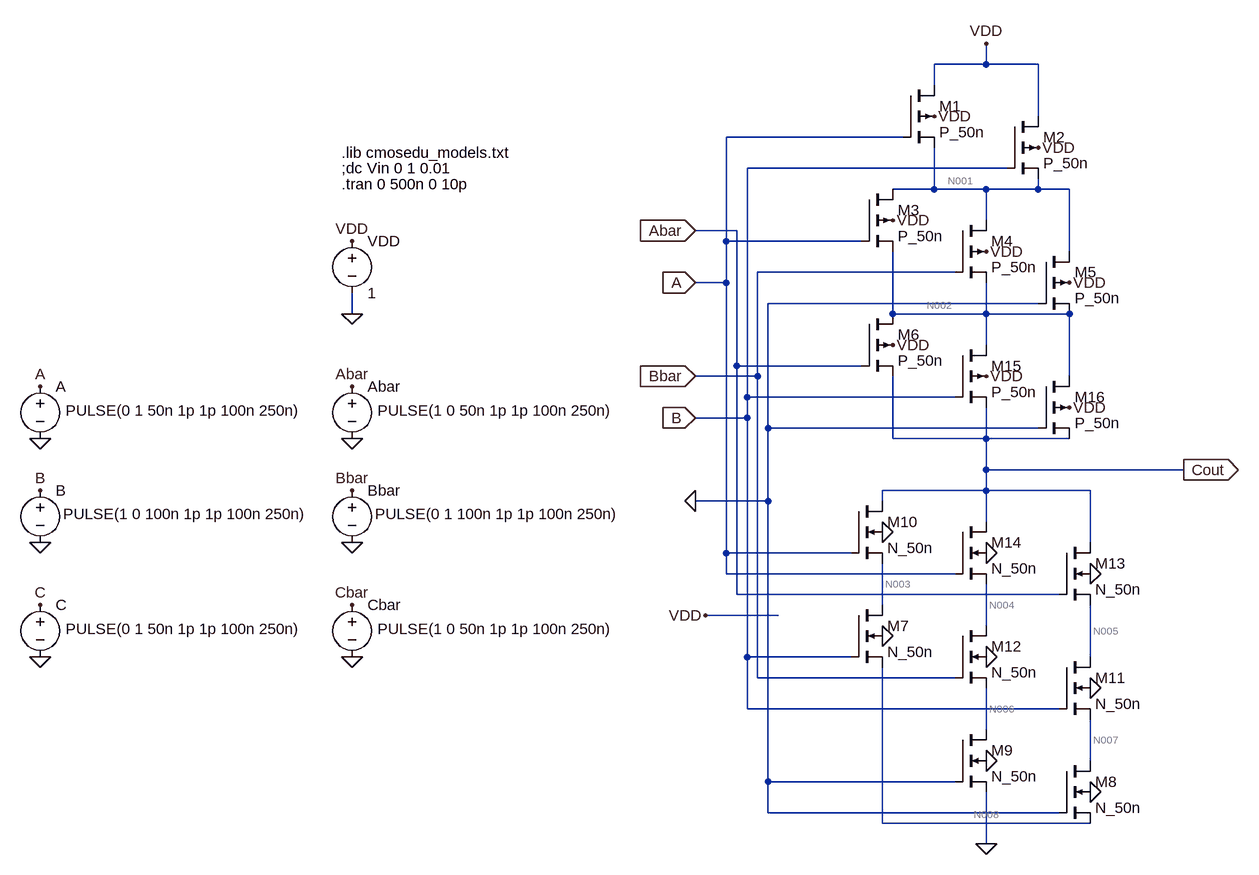
[diagram p0: schematic FA.asc]
FA.asc, the LTspice schematic file:
Version 4
SHEET 1 1044 680
WIRE 96 -624 96 -656
WIRE 96 -624 16 -624
WIRE 176 -624 96 -624
WIRE 16 -592 16 -624
WIRE 176 -544 176 -624
WIRE -32 -512 -304 -512
WIRE 128 -464 -272 -464
WIRE 16 -432 16 -496
WIRE 16 -432 -48 -432
WIRE 96 -432 16 -432
WIRE 176 -432 176 -448
WIRE 176 -432 96 -432
WIRE 224 -432 176 -432
WIRE 96 -384 96 -432
WIRE -288 -368 -352 -368
WIRE -304 -352 -304 -512
WIRE -96 -352 -304 -352
WIRE 224 -336 224 -432
WIRE 48 -304 -256 -304
WIRE -304 -288 -304 -352
WIRE -304 -288 -352 -288
WIRE 176 -256 -240 -256
WIRE -880 -240 -880 -272
WIRE -48 -240 -48 -336
WIRE 96 -240 96 -288
WIRE 96 -240 -48 -240
WIRE 224 -240 96 -240
WIRE 96 -192 96 -240
WIRE -288 -160 -288 -368
WIRE -96 -160 -288 -160
WIRE -256 -144 -256 -304
WIRE -256 -144 -352 -144
WIRE 224 -144 224 -240
WIRE -272 -112 -272 -464
WIRE 48 -112 -272 -112
WIRE -272 -80 -272 -112
WIRE -272 -80 -352 -80
WIRE -240 -64 -240 -256
WIRE 176 -64 -240 -64
WIRE -48 -48 -48 -144
WIRE 96 -48 96 -96
WIRE 96 -48 -48 -48
WIRE 224 -48 96 -48
WIRE 96 0 96 -48
WIRE 400 0 96 0
WIRE 96 32 96 0
WIRE 96 32 -64 32
WIRE 256 32 96 32
WIRE -240 48 -240 -64
WIRE -240 48 -352 48
WIRE -64 48 -64 32
WIRE 96 80 96 32
WIRE 256 112 256 32
WIRE -304 128 -304 -288
WIRE -112 128 -304 128
WIRE -304 160 -304 128
WIRE 48 160 -304 160
WIRE -288 192 -288 -160
WIRE 208 192 -288 192
WIRE -64 208 -64 144
WIRE -224 224 -336 224
WIRE 96 240 96 176
WIRE -272 288 -272 -80
WIRE -112 288 -272 288
WIRE 256 288 256 208
WIRE -256 320 -256 -144
WIRE 48 320 -256 320
WIRE -272 368 -272 288
WIRE 208 368 -272 368
WIRE 96 400 96 336
WIRE 256 448 256 384
WIRE -240 480 -240 48
WIRE 48 480 -240 480
WIRE -240 528 -240 480
WIRE 208 528 -240 528
WIRE -64 544 -64 304
WIRE 256 544 -64 544
WIRE 96 576 96 496
FLAG -880 -240 0
FLAG -880 -352 VDD
FLAG -880 -128 Abar
FLAG -880 32 Bbar
FLAG -880 -48 0
FLAG -880 112 0
FLAG 256 496 0
FLAG -64 256 0
FLAG 16 -544 VDD
FLAG 176 -496 VDD
FLAG 96 -336 VDD
FLAG -48 -384 VDD
FLAG -352 -368 Abar
IOPIN -352 -368 In
FLAG -352 -144 Bbar
IOPIN -352 -144 In
FLAG 96 576 0
FLAG 96 -656 VDD
FLAG 400 0 Cout
IOPIN 400 0 Out
FLAG -1360 -128 A
FLAG -1360 -48 0
FLAG -1360 32 B
FLAG -1360 112 0
FLAG -880 208 Cbar
FLAG -880 288 0
FLAG -1360 208 C
FLAG -1360 288 0
FLAG 96 448 0
FLAG 256 336 0
FLAG -64 96 0
FLAG 96 288 0
FLAG 256 160 0
FLAG 96 128 0
FLAG -352 -288 A
IOPIN -352 -288 In
FLAG -352 -80 B
IOPIN -352 -80 In
FLAG 224 -288 VDD
FLAG 96 -144 VDD
FLAG -48 -192 VDD
FLAG 224 -96 VDD
FLAG -352 48 0
FLAG -336 224 VDD
SYMBOL voltage -880 -368 R0
SYMATTR InstName VDD
SYMATTR Value 1
SYMBOL voltage -880 -144 R0
WINDOW 3 39 53 Left 2
WINDOW 123 0 0 Left 0
WINDOW 39 0 0 Left 0
SYMATTR Value PULSE(1 0 50n 1p 1p 100n 250n)
SYMATTR InstName Abar
SYMBOL voltage -880 16 R0
WINDOW 123 0 0 Left 0
WINDOW 39 0 0 Left 0
WINDOW 3 35 52 Left 2
SYMATTR Value PULSE(0 1 100n 1p 1p 100n 250n)
SYMATTR InstName Bbar
SYMBOL pmos4 -32 -592 R0
SYMATTR InstName M1
SYMATTR Value P_50n
SYMATTR Value2 l=50n w=0.12u
SYMBOL pmos4 128 -544 R0
SYMATTR InstName M2
SYMATTR Value P_50n
SYMATTR Value2 l=50n w=0.6u
SYMBOL pmos4 -96 -432 R0
SYMATTR InstName M3
SYMATTR Value P_50n
SYMATTR Value2 l=50n w=0.12u
SYMBOL pmos4 48 -384 R0
SYMATTR InstName M4
SYMATTR Value P_50n
SYMATTR Value2 l=50n w=0.12u
SYMBOL nmos4 -112 208 R0
SYMATTR InstName M7
SYMATTR Value N_50n
SYMATTR Value2 l=50n w=0.4u
SYMBOL nmos4 208 448 R0
SYMATTR InstName M8
SYMATTR Value N_50n
SYMATTR Value2 l=50n w=0.6u
SYMBOL voltage -1360 -144 R0
WINDOW 3 39 53 Left 2
WINDOW 123 0 0 Left 0
WINDOW 39 0 0 Left 0
SYMATTR Value PULSE(0 1 50n 1p 1p 100n 250n)
SYMATTR InstName A
SYMBOL voltage -1360 16 R0
WINDOW 123 0 0 Left 0
WINDOW 39 0 0 Left 0
WINDOW 3 35 52 Left 2
SYMATTR Value PULSE(1 0 100n 1p 1p 100n 250n)
SYMATTR InstName B
SYMBOL voltage -880 192 R0
WINDOW 3 39 53 Left 2
WINDOW 123 0 0 Left 0
WINDOW 39 0 0 Left 0
SYMATTR Value PULSE(1 0 50n 1p 1p 100n 250n)
SYMATTR InstName Cbar
SYMBOL voltage -1360 192 R0
WINDOW 3 39 53 Left 2
WINDOW 123 0 0 Left 0
WINDOW 39 0 0 Left 0
SYMATTR Value PULSE(0 1 50n 1p 1p 100n 250n)
SYMATTR InstName C
SYMBOL nmos4 48 400 R0
SYMATTR InstName M9
SYMATTR Value N_50n
SYMATTR Value2 l=50n w=0.6u
SYMBOL nmos4 -112 48 R0
SYMATTR InstName M10
SYMATTR Value N_50n
SYMATTR Value2 l=50n w=0.4u
SYMBOL nmos4 208 288 R0
SYMATTR InstName M11
SYMATTR Value N_50n
SYMATTR Value2 l=50n w=0.6u
SYMBOL nmos4 48 240 R0
SYMATTR InstName M12
SYMATTR Value N_50n
SYMATTR Value2 l=50n w=0.6u
SYMBOL nmos4 208 112 R0
SYMATTR InstName M13
SYMATTR Value N_50n
SYMATTR Value2 l=50n w=0.6u
SYMBOL nmos4 48 80 R0
SYMATTR InstName M14
SYMATTR Value N_50n
SYMATTR Value2 l=50n w=0.6u
SYMBOL pmos4 176 -336 R0
SYMATTR InstName M5
SYMATTR Value P_50n
SYMATTR Value2 l=50n w=0.12u
SYMBOL pmos4 -96 -240 R0
SYMATTR InstName M6
SYMATTR Value P_50n
SYMATTR Value2 l=50n w=0.12u
SYMBOL pmos4 48 -192 R0
SYMATTR InstName M15
SYMATTR Value P_50n
SYMATTR Value2 l=50n w=0.12u
SYMBOL pmos4 176 -144 R0
SYMATTR InstName M16
SYMATTR Value P_50n
SYMATTR Value2 l=50n w=0.12u
TEXT -896 -464 Left 2 !;dc Vin 0 1 0.01
TEXT -896 -488 Left 2 !.lib cmosedu_models.txt
TEXT -896 -440 Left 2 !.tran 0 500n 0 10p

The netlist it stands for:
* FA.asc
VDD VDD 0 1
V§Abar Abar 0 PULSE(1 0 50n 1p 1p 100n 250n)
V§Bbar Bbar 0 PULSE(0 1 100n 1p 1p 100n 250n)
M1 VDD A N001 VDD P_50n l=50n w=0.12u
M2 VDD B N001 VDD P_50n l=50n w=0.6u
M3 N001 A N002 VDD P_50n l=50n w=0.12u
M4 N001 Bbar N002 VDD P_50n l=50n w=0.12u
M7 N003 B N008 0 N_50n l=50n w=0.4u
M8 N007 0 N008 0 N_50n l=50n w=0.6u
V§A A 0 PULSE(0 1 50n 1p 1p 100n 250n)
V§B B 0 PULSE(1 0 100n 1p 1p 100n 250n)
V§Cbar Cbar 0 PULSE(1 0 50n 1p 1p 100n 250n)
V§C C 0 PULSE(0 1 50n 1p 1p 100n 250n)
M9 N006 0 0 0 N_50n l=50n w=0.6u
M10 Cout A N003 0 N_50n l=50n w=0.4u
M11 N005 B N007 0 N_50n l=50n w=0.6u
M12 N004 Bbar N006 0 N_50n l=50n w=0.6u
M13 Cout Abar N005 0 N_50n l=50n w=0.6u
M14 Cout A N004 0 N_50n l=50n w=0.6u
M5 N001 0 N002 VDD P_50n l=50n w=0.12u
M6 N002 Abar Cout VDD P_50n l=50n w=0.12u
M15 N002 B Cout VDD P_50n l=50n w=0.12u
M16 N002 0 Cout VDD P_50n l=50n w=0.12u
.model NMOS NMOS
.model PMOS PMOS
.lib standard.mos
;dc Vin 0 1 0.01
.lib cmosedu_models.txt
.tran 0 500n 0 10p
.backanno
.end

* Results of the author's LTspice run, read from the files saved beside the schematic
* Operating Point, zero values left out:
*   V(vdd) = 1 V
*   V(abar) = 1 V
*   V(n001) = 999.9 mV
*   V(b) = 1 V
*   V(n002) = 999.8 mV
*   V(n003) = 495.9 mV
*   V(n008) = 495.9 mV
*   V(n007) = 925.3 mV
*   V(cbar) = 1 V
*   V(n006) = 15.95 mV
*   V(cout) = 999.8 mV
*   V(n005) = 943.2 mV
*   V(n004) = 53.61 mV
*   Id(M14) = 1.315 nA
*   Ig(M14) = -747.2 pA
*   Ib(M14) = -1.054 pA
*   Is(M14) = -566.6 pA
*   Id(M13) = 521.9 pA
*   Ib(M13) = -1.945 pA
*   Is(M13) = -520 pA
*   Id(M12) = 566.6 pA
*   Is(M12) = -566.3 pA
*   Id(M11) = 520 pA
*   Ib(M11) = -1.871 pA
*   Is(M11) = -518.2 pA
*   Id(M10) = 494.8 pA
*   Ig(M10) = -523.1 pA
*   Ib(M10) = -1.496 pA
*   Is(M10) = 29.87 pA
*   Id(M9) = 566.3 pA
*   Is(M9) = -566.2 pA
*   Id(M8) = 518.2 pA
*   Ig(M8) = -561.7 pA
*   Ib(M8) = -1.421 pA
*   Is(M8) = 44.93 pA
*   Id(M7) = -29.87 pA
*   Ig(M7) = 75.8 pA
*   Ib(M7) = -1.001 pA
*   Is(M7) = -44.93 pA
*   Id(M16) = 4.266 nA
*   Ig(M16) = -1.951 nA
*   Ib(M16) = 15.44 pA
*   Is(M16) = -2.331 nA
*   Id(M5) = 3.358 nA
*   Ig(M5) = -1.951 nA
*   Ib(M5) = 15.45 pA
*   Is(M5) = -1.422 nA
*   Id(M4) = 3.358 nA
*   Ig(M4) = -1.951 nA
*   Ib(M4) = 15.45 pA
*   Is(M4) = -1.422 nA
*   Id(M3) = 3.358 nA
*   Ig(M3) = -1.951 nA
*   Ib(M3) = 15.45 pA
*   Is(M3) = -1.422 nA
*   Id(M2) = 3.301 pA
*   Is(M2) = -3.306 pA
*   Id(M1) = 12.01 nA
*   Ig(M1) = -1.951 nA
*   Ib(M1) = 15.48 pA
*   Is(M1) = -10.07 nA
*   I(B) = -75.95 pA
*   I(A) = 5.173 nA
*   I(Bbar) = 1.951 nA
*   I(Vdd) = -12.09 nA
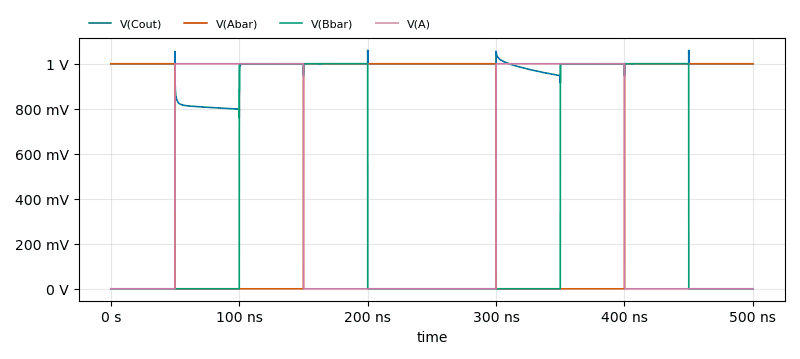
[diagram p1: Transient Analysis of FA.asc, plotted from the saved traces]
* Transient Analysis, 1 run:
*   V(Cout): min 760 mV, max 1.06 V, average 978.7 mV, rms 980.3 mV, last 999.8 mV
*   V(Abar): min 0 V, max 1 V, average 600 mV, rms 774.6 mV, last 1 V
*   V(Bbar): min 0 V, max 1 V, average 400 mV, rms 632.5 mV, last 0 V
*   V(A): min 0 V, max 1 V, average 400 mV, rms 632.5 mV, last 0 V